# Altium schematic sheet Main.SchDoc
size B; SheetNumber: 1; SheetTotal: 6; SPICEModelCacheZOZTKGSK: <root> / <DocumentId>ZOZTKGSK</DocumentId> / <CacheFrame Number="0"> / <Model Name="mac15a8" Kind="CKT"> / <Text>*MAC15A8 MCE 2-27-96 / *600V 15A pkg:TO-220 2,3,1 / .SUBCKT MAC15A8   1  2  3 / *     TERMINALS: MT2 G MT1 / QN1  5 4 3  NOUT OFF / QN2 11 6 7  NOUT OFF / QP1 6 11 3  POUT OFF / QP2  4 5 7  POUT OFF / DF  4  5  DZ OFF / DR  6 11  DZ OFF / RF  4 6  60MEG / RT2 1 7  18.8M / RH  7 6  87.5 / RGP 8 3  23.1 / RG  2 8  11.5 / RS  8 4  102 / DN  9 2  DIN OFF / RN  9 3  41.6 / GNN  6 7 9 3 15.2M / GNP  4 5 9 3 18.1M / DP 2 10  DIP OFF / RP 10 3  29.5 / GP  7 6 10 3 10.3M / .MODEL DIN  D (IS=45.8F) / .MODEL DIP  D (IS=45.8F N=1.2) / .MODEL DZ   D (IS=45.8F N=1.5 IBV=10U BV=600) / .MODEL POUT PNP (IS=45.8F BF=5 CJE=4.02N TF=38.2U) / .MODEL NOUT NPN (IS=45.8F BF=20 CJE=4.02N CJC=804P TF=2.55U) / .ENDS MAC15A8</Text> / </Model> / </CacheFrame> / </root>
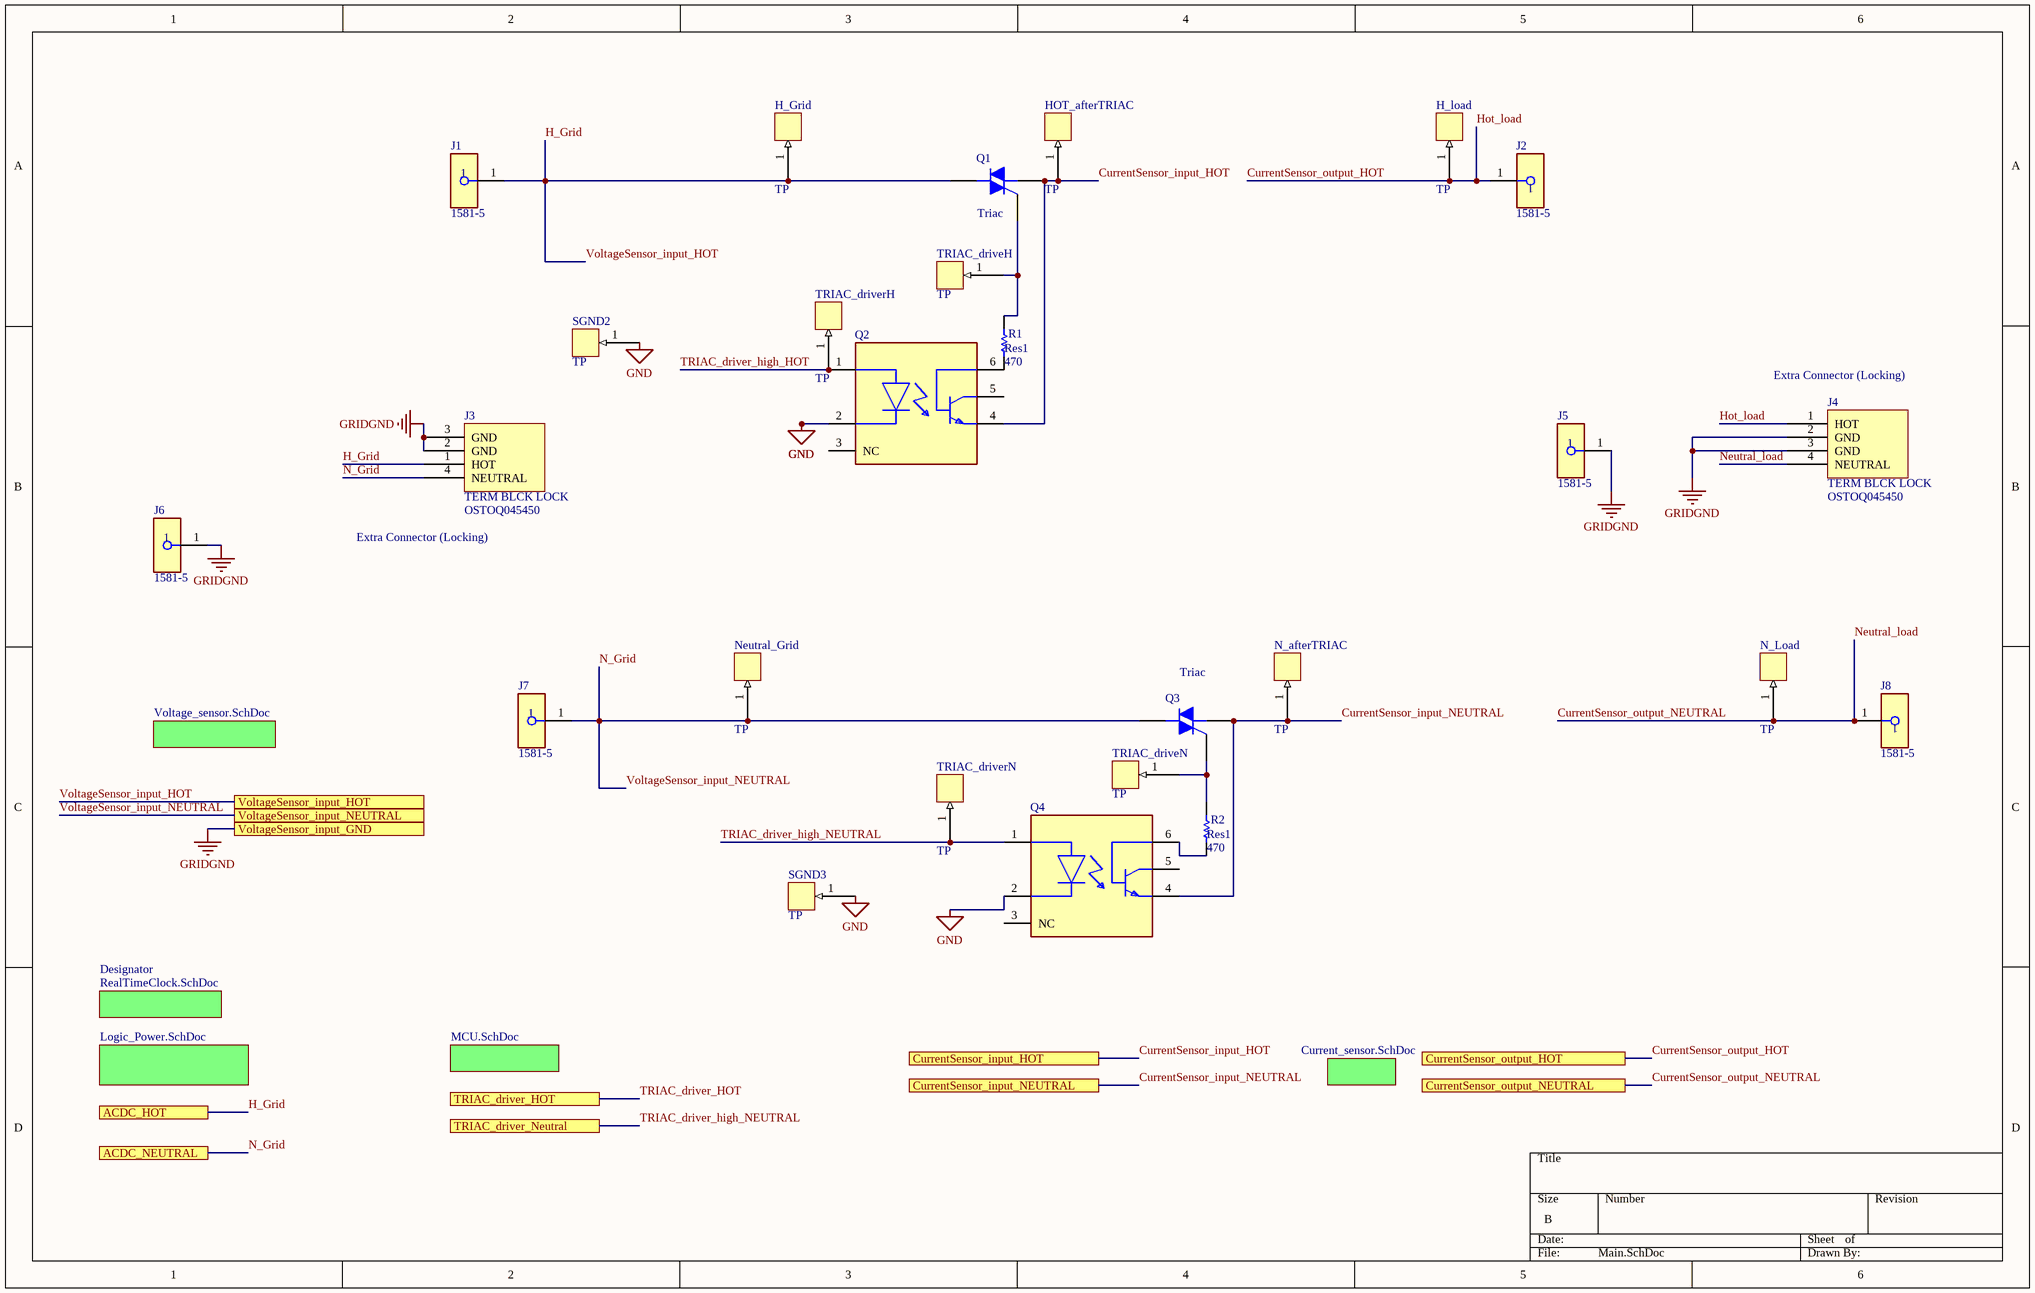
[diagram p0: Main.SchDoc]

## Parts
H_Grid  TP  [TP]
H_load  TP  [TP]
HOT_afterTRIAC  TP  [TP]
J1  1581-5  [FP-1581-5-MFG]
J2  1581-5  [FP-1581-5-MFG]
J3  OSTOQ045450  [block]
J4  OSTOQ045450  [block]
J5  1581-5  [FP-1581-5-MFG]
J6  1581-5  [FP-1581-5-MFG]
J7  1581-5  [FP-1581-5-MFG]
J8  1581-5  [FP-1581-5-MFG]
N_afterTRIAC  TP  [TP]
N_Load  TP  [TP]
Neutral_Grid  TP  [TP]
Q1  Triac  [TO-220AB]
Q2  (no value)  [FP-22530-MFG]
Q3  Triac  [TO-220AB]
Q4  (no value)  [FP-22530-MFG]
R1  Res1  value 470  [0603]
R2  Res1  value 470  [0603]
SGND2  TP  [TP]
SGND3  TP  [TP]
TRIAC_driveH  TP  [TP]
TRIAC_driveN  TP  [TP]
TRIAC_driverH  TP  [TP]
TRIAC_driverN  TP  [TP]

## Sub-sheets
Designator = RealTimeClock.SchDoc: no entries
? = Current_sensor.SchDoc: no entries
? = Voltage_sensor.SchDoc: no entries
? = MCU.SchDoc: no entries
? = Logic_Power.SchDoc: no entries

## Ports
ACDC_HOT, ACDC_NEUTRAL, CurrentSensor_input_HOT, CurrentSensor_input_NEUTRAL, CurrentSensor_output_HOT, CurrentSensor_output_NEUTRAL, TRIAC_driver_HOT, TRIAC_driver_Neutral, VoltageSensor_input_GND, VoltageSensor_input_HOT, VoltageSensor_input_NEUTRAL

## Nets
GND: Q2.2(C) Q4.2(C) SGND2.1 SGND3.1
GRIDGND: J3.2(GND) J3.3(GND) J4.2(GND) J4.3(GND) J5.1 J6.1 ; port VoltageSensor_input_GND
CurrentSensor_input_HOT: HOT_afterTRIAC.1 Q1.1(M1) Q2.4(E) ; port CurrentSensor_input_HOT
CurrentSensor_input_NEUTRAL: N_afterTRIAC.1 Q3.1(M1) Q4.4(E) ; port CurrentSensor_input_NEUTRAL
CurrentSensor_output_HOT: H_load.1 J2.1 J4.1(HOT) ; port CurrentSensor_output_HOT  [also labelled Hot_load]
CurrentSensor_output_NEUTRAL: J4.4(NEUTRAL) J8.1 N_Load.1 ; port CurrentSensor_output_NEUTRAL  [also labelled Neutral_load]
H_Grid: H_Grid.1 J1.1 J3.1(HOT) Q1.2(M2) ; port ACDC_HOT, port VoltageSensor_input_HOT  [also labelled VoltageSensor_input_HOT]
N_Grid: J3.4(NEUTRAL) J7.1 Neutral_Grid.1 Q3.2(M2) ; port ACDC_NEUTRAL, port VoltageSensor_input_NEUTRAL  [also labelled VoltageSensor_input_NEUTRAL]
TRIAC_driver_high_HOT: Q2.1(A) TRIAC_driverH.1
TRIAC_driver_high_NEUTRAL: Q4.1(A) TRIAC_driverN.1 ; port TRIAC_driver_Neutral
TRIAC_driver_HOT: port TRIAC_driver_HOT
NetQ1_3: Q1.3(G) R1.2 TRIAC_driveH.1
NetQ2_6: Q2.6(B) R1.1
NetQ3_3: Q3.3(G) R2.2 TRIAC_driveN.1
NetQ4_6: Q4.6(B) R2.1

Not connected (* = marked no-connect by the designer): Q2 3(NC) 5(C); Q4 3(NC) 5(C)

## Notes on the sheet
- (near J4) Extra Connector (Locking)
- Extra Connector (Locking)
- (in symbol OSTOQ045450) TERM BLCK LOCK

## Library data of the parts
J1 J2 J5-J8 = CMP-73906-000011-1: CONN BANANA JACK TURRET GREEN; Body Material: PC; Number of Contacts: 1; Max Current Rating: 15A; Voltage Rating (AC): 30V; Insulation: Mating End Insulated; Voltage Rating: 2.5kV; Voltage Rating (DC): 60V; Gender: Female; Height: 0.25inch; Mount: Panel; RoHS Compliant: Yes; Length: 1.22inch; Orientation: Straight; Diameter: 4.22mm; Lead Free: Lead Free; Package Quantity: 1; Termination: Turret; Current Rating: 15A; Packaging: Bag; Series: 1581; REACH SVHC: No SVHC; Number of Positions: 1; Contact Plating: Tin; Housing Color: Green; Contact Material: Brass; Insulation Material: Polycarbonate; Weight: 0.126lb; Number of Ports: 1; Color: Green; Housing Material: Polycarbonate; Width: 4inch
Q1 Q3 = Triac: Silicon Bidirectional Triode Thyristor; Note: Pin 2 is electrically connected to Pin 4 (TAB); Published: 29-Sep-2000; LatestRevisionDate: 17-Jul-2002; LatestRevisionNote: Re-released for DXP Platform.; DatasheetVersion: 1999; PackageReference: 369-03; Publisher: Altium Limited; PackageDescription: TO, Thru-Hole, Vertical, Heatsink Mounted; 3 In-Line Leads; Pitch 2.28 mm; ComponentLink2Description: Digikey Link
  Q1: ComponentLink2URL: https://www.digikey.com/en/products/detail/ween-semiconductors/MAC223A6-12a7/1156589
  Q3: ComponentLink2URL: https://www.digikey.com/en/products/detail/ween-semiconductors/MAC223A6-127/1156589
Q2 Q4 = CMP-2000-05429-2: OPTOISO 5KV TRANS W/BASE 6DIP; Max Input Current: 60mA; Max Output Voltage: 70V; Power Dissipation: 150mW; Number of Elements: 1; Voltage Rating (DC): 32V; Reverse Breakdown Voltage: 6V; Fall Time: 14us; Current Transfer Ratio: 200%; Turn-Off Delay Time: 2.3us; Forward Voltage: 1.65V; Max Collector Current: 100mA; Collector Emitter Saturation Voltage: 400mV; Approvals: VDE; Rise Time: 3us; Package Quantity: 2000; Contact Plating: Tin; Max Power Dissipation: 150mW; Packaging: Rail/Tube; Number of Channels: 1; Lead Free: Lead Free; Mount: Through Hole; Output Voltage: 70V; Min Operating Temperature: -55°C; Case/Package: DIP; Forward Current: 60mA; Collector Emitter Voltage (VCEO): 70V; Max Operating Temperature: 100°C; Input Current: 60mA; Radiation Hardening: No; Number of Pins: 6; Output Current per Channel: 100mA; Isolation Voltage: 5kV; Collector Emitter Breakdown Voltage: 70V; Turn-On Delay Time: 3us
R1 R2 = Res1: Resistor; Published: 8-Jun-2000; LatestRevisionDate: 17-Jul-2002; LatestRevisionNote: Re-released for DXP Platform.; PackageReference: AXIAL-0.3; Publisher: Altium Limited; PackageDescription: Axial Device, Thru-Hole; 2 Leads; 0.3 in Pin Spacing